# EAGLE design Blocky_Uno_v2 (EAGLE 9.2.2)
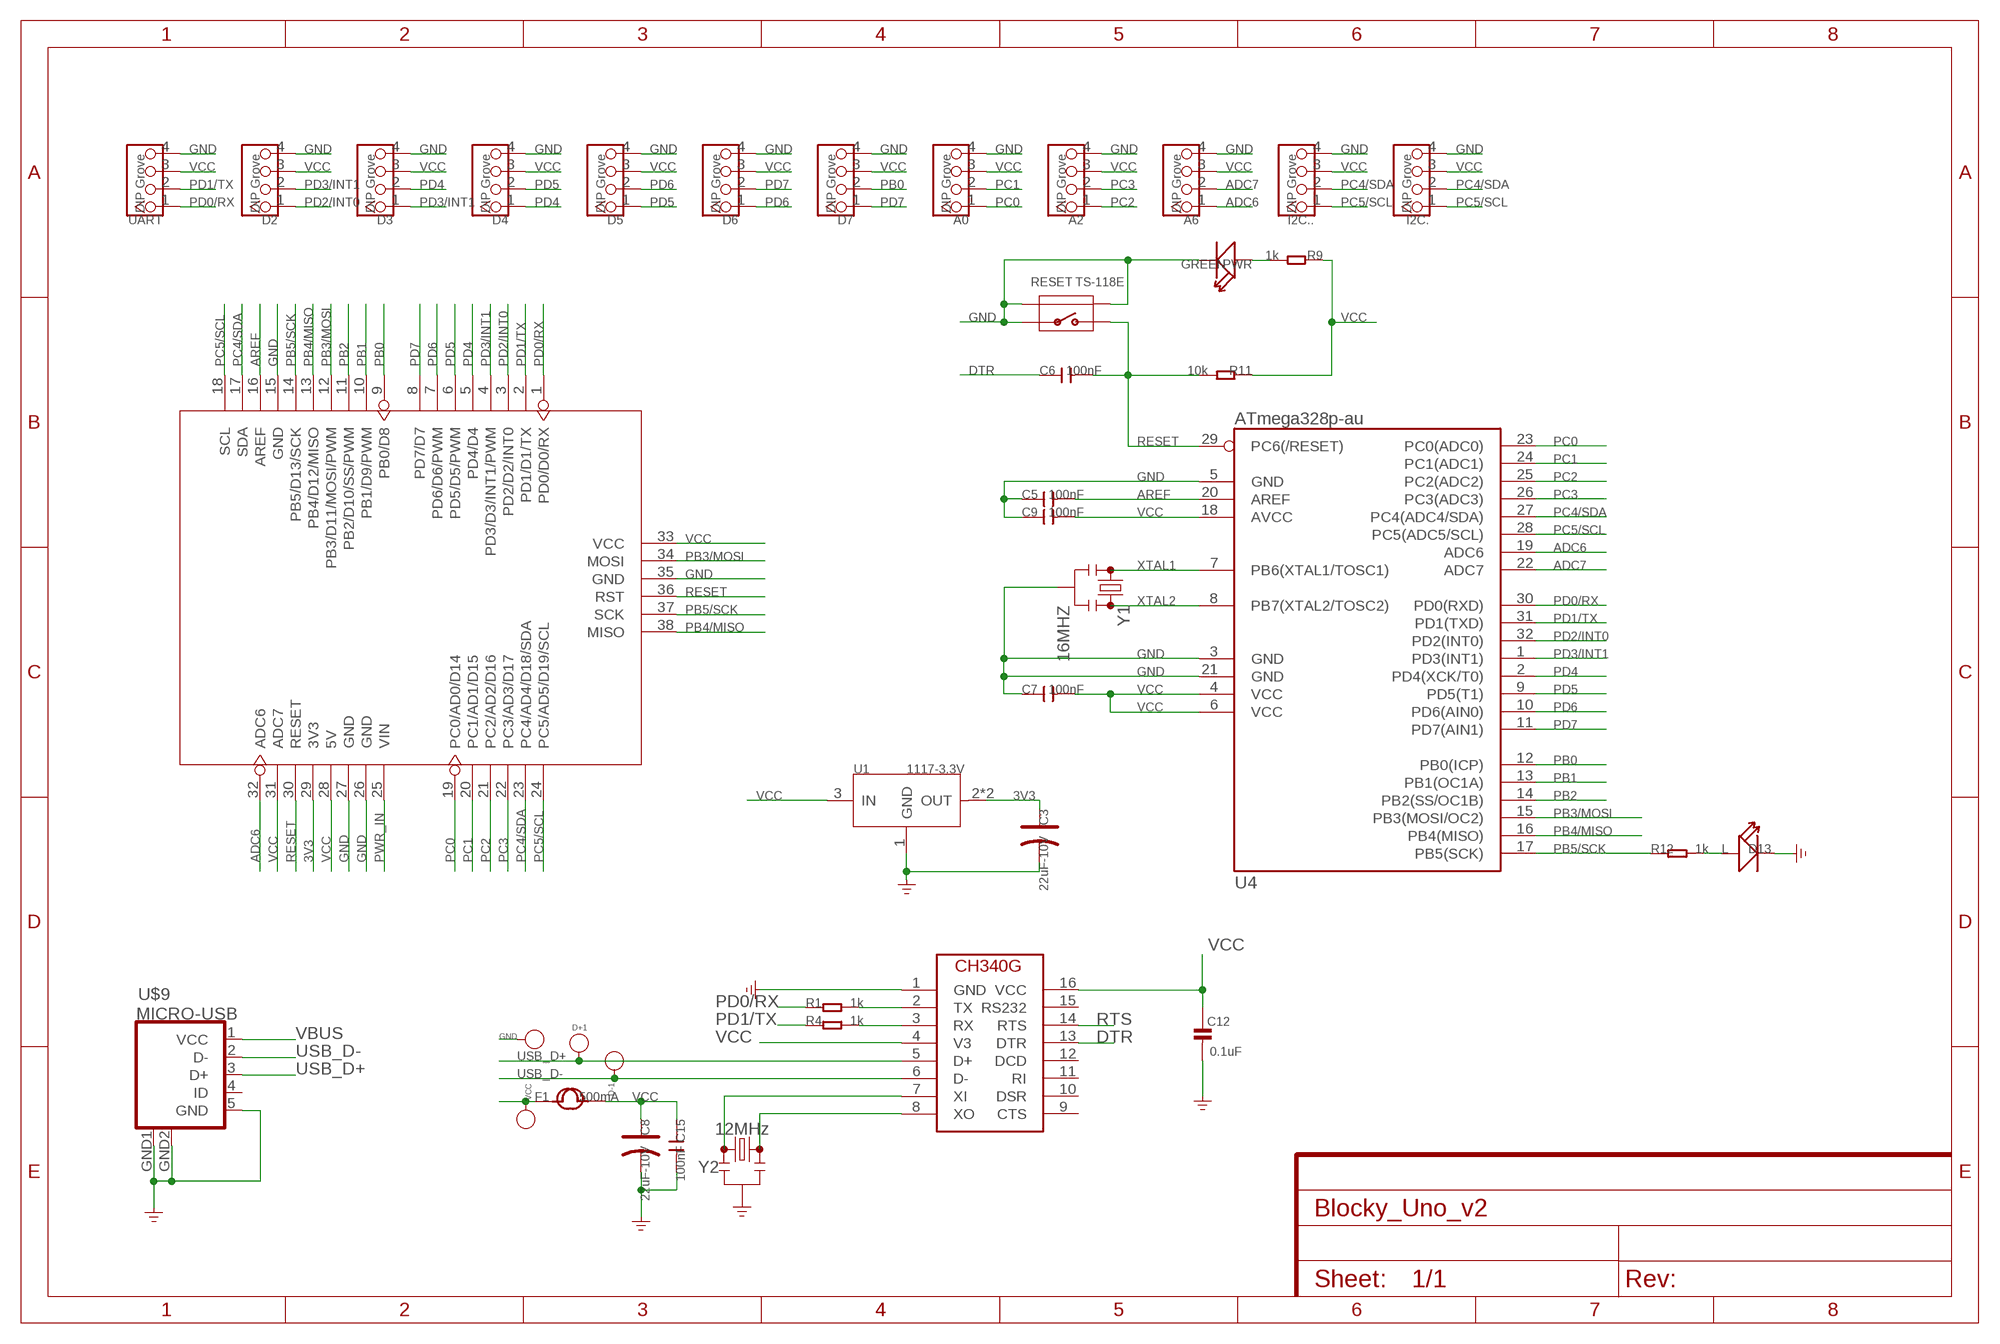
[diagram p0: schematic, sheet 1]

## Parts
A0  DIP Grove  TWIG-4P-2.0-2.0  [4P-2.0]
A2  DIP Grove  TWIG-4P-2.0-2.0  [4P-2.0]
A6  DIP Grove  TWIG-4P-2.0-2.0  [4P-2.0]
C3  22uF-10V  CAP-AVX-A  [AVX-A]
C5  100nF  C-0603  [C0603]
C6  100nF  C-0603  [C0603]
C7  100nF  C-0603  [C0603]
C8  22uF-10V  CAP-AVX-A  [AVX-A]
C9  100nF  C-0603  [C0603]
C12  0.1uF  CAP_CERAMIC_0603  [_0603]
C15  100nF  C-0603  [C0603]
D2  DIP Grove  TWIG-4P-2.0-2.0  [4P-2.0]
D3  DIP Grove  TWIG-4P-2.0-2.0  [4P-2.0]
D4  DIP Grove  TWIG-4P-2.0-2.0  [4P-2.0]
D5  DIP Grove  TWIG-4P-2.0-2.0  [4P-2.0]
D6  DIP Grove  TWIG-4P-2.0-2.0  [4P-2.0]
D7  DIP Grove  TWIG-4P-2.0-2.0  [4P-2.0]
D+1  PAD-TEST-POINT'4545'  [TP_4545]
D-1  PAD-TEST-POINT'4545'  [TP_4545]
F1  500mA  FUSE'1206'  [F1206]
GND  PAD-TEST-POINT'4545'  [TP_4545]
I2C.  DIP Grove  TWIG-4P-2.0-2.0  [4P-2.0]
I2C..  DIP Grove  TWIG-4P-2.0-2.0  [4P-2.0]
L  D13  LED'0603'  [LED-0603]
PWR  GREEN  LED'0603'  [LED-0603]
R1  1k  R-0603  [R0603]
R4  1k  R-0603  [R0603]
R9  1k  R-0603  [R0603]
R11  10k  R-0603  [R0603]
R12  1k  R-0603  [R0603]
RESET  TS-118E  BUTTON-4P-REINFORCE'TS-1188E'  [4P-SMD-7X3.5X3.5H]
U1  1117-3.3V  LD1117'SOT89'  [SOT89]
U3  ARDUINO-38P  [ARDUINO-38P]
U4  ATmega328p-au  ATMEGA8/168/328  [TQFP32]
U$9  MICRO-USB  [MICRO-USB]
U$44  CH340G  [SOIC16]
UART  DIP Grove  TWIG-4P-2.0-2.0  [4P-2.0]
VCC  PAD-TEST-POINT'4545'  [TP_4545]
Y1  16MHZ  RESONATOR16MHZ  [RESONATOR-SMD]
Y2  12MHz  RESONATOR-16MHZSMD_3.2X1.3  [RESONATOR-SMD-3.2X1.3]

## Nets
3V3: C3.+ U1.2(OUT) U1.4(OUT) U3.29(3V3)
ADC6: A6.1 U3.32(ADC6) U4.19(ADC6)
ADC7: A6.2 U4.22(ADC7)
AREF: C5.2 U3.16(AREF) U4.20(AREF)
DTR: C6.1 U$44.13(DTR)
GND: A0.4 A2.4 A6.4 C3.- C5.1 C7.1 C8.- C9.1 C12.2 C15.2 D2.4 D3.4 D4.4 D5.4 D6.4 D7.4 GND.T I2C..4 I2C...4 L.- PWR.- RESET.1 RESET.S1 RESET.S2 U1.1(GND) U3.15(GND) U3.26(GND) U3.27(GND) U3.35(GND) U4.3(GND) U4.5(GND) U4.21(GND) U$9.5(GND) U$9.GND1(GND) U$9.GND2(GND) U$44.1(GND) UART.4 Y1.2 Y2.2
N$3: PWR.+ R9.2
N$6: U$44.7(XI) Y2.1
N$10: U$44.8(XO) Y2.3
N$13: L.+ R12.2
N$21: R1.2 U$44.2(TX)
N$27: R4.2 U$44.3(RX)
PB0: D7.2 U3.9(PB0/D8) U4.12(PB0(ICP))
PB1: U3.10(PB1/D9/PWM) U4.13(PB1(OC1A))
PB2: U3.11(PB2/D10/SS/PWM) U4.14(PB2(SS/OC1B))
PB3/MOSI: U3.12(PB3/D11/MOSI/PWM) U3.34(MOSI) U4.15(PB3(MOSI/OC2))
PB4/MISO: U3.13(PB4/D12/MISO) U3.38(MISO) U4.16(PB4(MISO))
PB5/SCK: R12.1 U3.14(PB5/D13/SCK) U3.37(SCK) U4.17(PB5(SCK))
PC0: A0.1 U3.19(PC0/AD0/D14) U4.23(PC0(ADC0))
PC1: A0.2 U3.20(PC1/AD1/D15) U4.24(PC1(ADC1))
PC2: A2.1 U3.21(PC2/AD2/D16) U4.25(PC2(ADC2))
PC3: A2.2 U3.22(PC3/AD3/D17) U4.26(PC3(ADC3))
PC4/SDA: I2C..2 I2C...2 U3.17(SDA) U3.23(PC4/AD4/D18/SDA) U4.27(PC4(ADC4/SDA))
PC5/SCL: I2C..1 I2C...1 U3.18(SCL) U3.24(PC5/AD5/D19/SCL) U4.28(PC5(ADC5/SCL))
PD0/RX: R1.1 U3.1(PD0/D0/RX) U4.30(PD0(RXD)) UART.1
PD1/TX: R4.1 U3.2(PD1/D1/TX) U4.31(PD1(TXD)) UART.2
PD2/INT0: D2.1 U3.3(PD2/D2/INT0) U4.32(PD2(INT0))
PD3/INT1: D2.2 D3.1 U3.4(PD3/D3/INT1/PWM) U4.1(PD3(INT1))
PD4: D3.2 D4.1 U3.5(PD4/D4) U4.2(PD4(XCK/T0))
PD5: D4.2 D5.1 U3.6(PD5/D5/PWM) U4.9(PD5(T1))
PD6: D5.2 D6.1 U3.7(PD6/D6/PWM) U4.10(PD6(AIN0))
PD7: D6.2 D7.1 U3.8(PD7/D7) U4.11(PD7(AIN1))
PWR_IN: U3.25(VIN)
RESET: C6.2 R11.2 RESET.2 U3.30(RESET) U3.36(RST) U4.29(PC6(/RESET))
RTS: U$44.14(RTS)
USB_D+: D+1.T U$9.3(D+) U$44.5(D+)
USB_D-: D-1.T U$9.2(D-) U$44.6(D-)
VBUS [usbvcc]: F1.1 U$9.1(VCC) VCC.T
VCC: A0.3 A2.3 A6.3 C7.2 C8.+ C9.2 C12.1 C15.1 D2.3 D3.3 D4.3 D5.3 D6.3 D7.3 F1.2 I2C..3 I2C...3 R9.1 R11.1 U1.3(IN) U3.28(5V) U3.31(ADC7) U3.33(VCC) U4.4(VCC) U4.6(VCC) U4.18(AVCC) U$44.4(V3) U$44.16(VCC) UART.3
XTAL1: U4.7(PB6(XTAL1/TOSC1)) Y1.1
XTAL2: U4.8(PB7(XTAL2/TOSC2)) Y1.3
Unconnected: U$9.4(ID) U$44.9(CTS) U$44.10(DSR) U$44.11(RI) U$44.12(DCD) U$44.15(RS232)

## Library data of the parts
A0 A2 A6 = Connector :TWIG-4P-2.0
C3 C8 = Discrete:CAP*: Electrolytic Capacitors,Tantalum Capacitors and Super Capacitors
C5-C7 C9 C15 = Discrete:C*: Ceramic Capacitors
C12 = microbuilder:CAP_CERAMIC: Ceramic Capacitors 0402 - 0402 Surface Mount Capacitors 16pF 50V 5% [Digikey: 445-4899-2-ND] 18pF 50V 5% [Digikey: 490-1281-2-ND] 22pF 50V 5% [Digikey: 490-1283-2-ND] 68pF 50V 5% [Digikey: 490-1289-2-ND] 0.1uF 10V 10% [Digikey: 490-1318-2-ND] 1.0uF 6.3V 10% [Digikey: 490-1320-2-ND] 0603 - 0603 Surface Mount Capacitors 16 pF 50V 5% [Digikey: 445-5051-2-ND] 22 pF 50V [Digikey: PCC220ACVTR-ND] 33 pF 50V 5% [Digikey: 490-1415-1-ND] 56pF 50V 5% [Digikey: 490-1421-1-ND] 220pF 50V 5% [Digikey: 445-1285-1-ND] 680 pF 50V 2200 pF 50V 5% C0G [Digikey: 445-1297-1-ND] 5600 pF 100V 5% X7R [Digikey: 478-3711-1-ND] 0.1 µF 25V 10% [Digikey: PCC2277TR-ND] 0.22 µF 16V 10% X7R [Digikey: 445-1318-1-ND] 1.0 µF 25V 10% [Digikey: 445-5146-2-ND] 0603 - RF Specific 3pF 250V +/-0.1pF RF [Digikey: 712-1347-1-ND] 18 pF 250V 5% [Digikey: 478-3505-1-ND or 712-1322-1-ND] 56 pF 250V 5% C0G RF [Digikey: 490-4867-1-ND] 68 pF 250V RF [Digikey: 490-4868-1-ND] 0805 - 0805 Surface Mount Capacitors 220 pF 250V 2% RF Ceramic Capacitor [Digikey: 712-1398-1-ND] 1000 pF 50V 2% NP0 Ceramic Capacitor [Digikey: 478-3760-1-ND] 0.1 µF 25V 10% Ceramic Capacitor [Digikey: PCC1828TR-ND] 1.0 µF 16V 10% Ceramic Capacitor[Digikey: 490-1691-2-ND] 10.0 µF 10V 10% Ceramic Capacitor[Digikey: 709-1228-1-ND] 10.0 uF 16V 10% Ceramic Capacitor [Digikey: 478-5165-2-ND] 47 uF 6.3V 20% Ceramic Capacitor [Digikey: 587-1779-1-ND or 399-5506-1-ND] 1206 - 1206 Surface Mount Capacitors 47uF 10V 20% Ceramic Capacitor [Digikey: 490-5528-1-ND or 399-5508-1-ND or 445-6010-1-ND] 100uF 6.3V -20%, +80% Y5V Ceramic Capacitor (Digikey: 490-4512-1-ND, Mouser: 81-GRM31CF50J107ZE1L)
D2-D7 I2C. I2C.. UART = Connector:TWIG-4P-2.0
D+1 D-1 GND VCC = Discrete:PAD-TEST-POINT; PARTNO: DNP
F1 = Discrete:FUSE
L PWR = Discrete:LED*
R1 R4 R9 R11 R12 = Discrete:R*
RESET = Discrete:BUTTON-4P-REINFORCE: TS-1188E http://www.best-dz.com/?thread-374-2.html
U1 = IC:LD1117: Low Drop Fixed And Adjustable Positive Voltage Regulators http://www.datasheetcatalog.org/datasheet/SGSThomsonMicroelectronics/mXuqtqv.pdf
U3 = moudle:ARDUINO-38P
U4 = IC:ATMEGA8/168/328: MICROCONTROLLER
U$9 = My-Eagle-Lib:MICRO-USB: Micro USB B connector
U$44 = My-Eagle-Lib:CH340G
Y1 = SparkFun-FreqCtrl:RESONATOR: Resonator Small SMD resonator. Used, eg, on the Arduino Pro/ Pro Mini boards. 8MHz- XTAL-08895 16MHz- XTAL-08900; PROD_ID: XTAL-08900
Y2 = SparkFun-Clocks:RESONATOR-16MHZ: 16MHz Resonator Digikey Example <http://www.digikey.com/product-detail/en/murata-electronics-north-america/CSTCE16M0V53-R0/490-1198-1-ND/584635> Frequency: 16MHz Frequency Stability: ±0.3% Frequency Tolerance: ±0.5% Capacitance: 15pF SparkFun Products SparkFun OpenLog <https://www.sparkfun.com/products/13712> SparkFun MicroView - OLED Arduino Module <https://www.sparkfun.com/products/12923>; PROD_ID: XTAL-08900; VALUE: 16MHz

## Net classes
1 power: width 0.381 mm
3 usbvcc: width 0.203 mm, drill 0.305 mm, clearance 0.203 mm

## Board
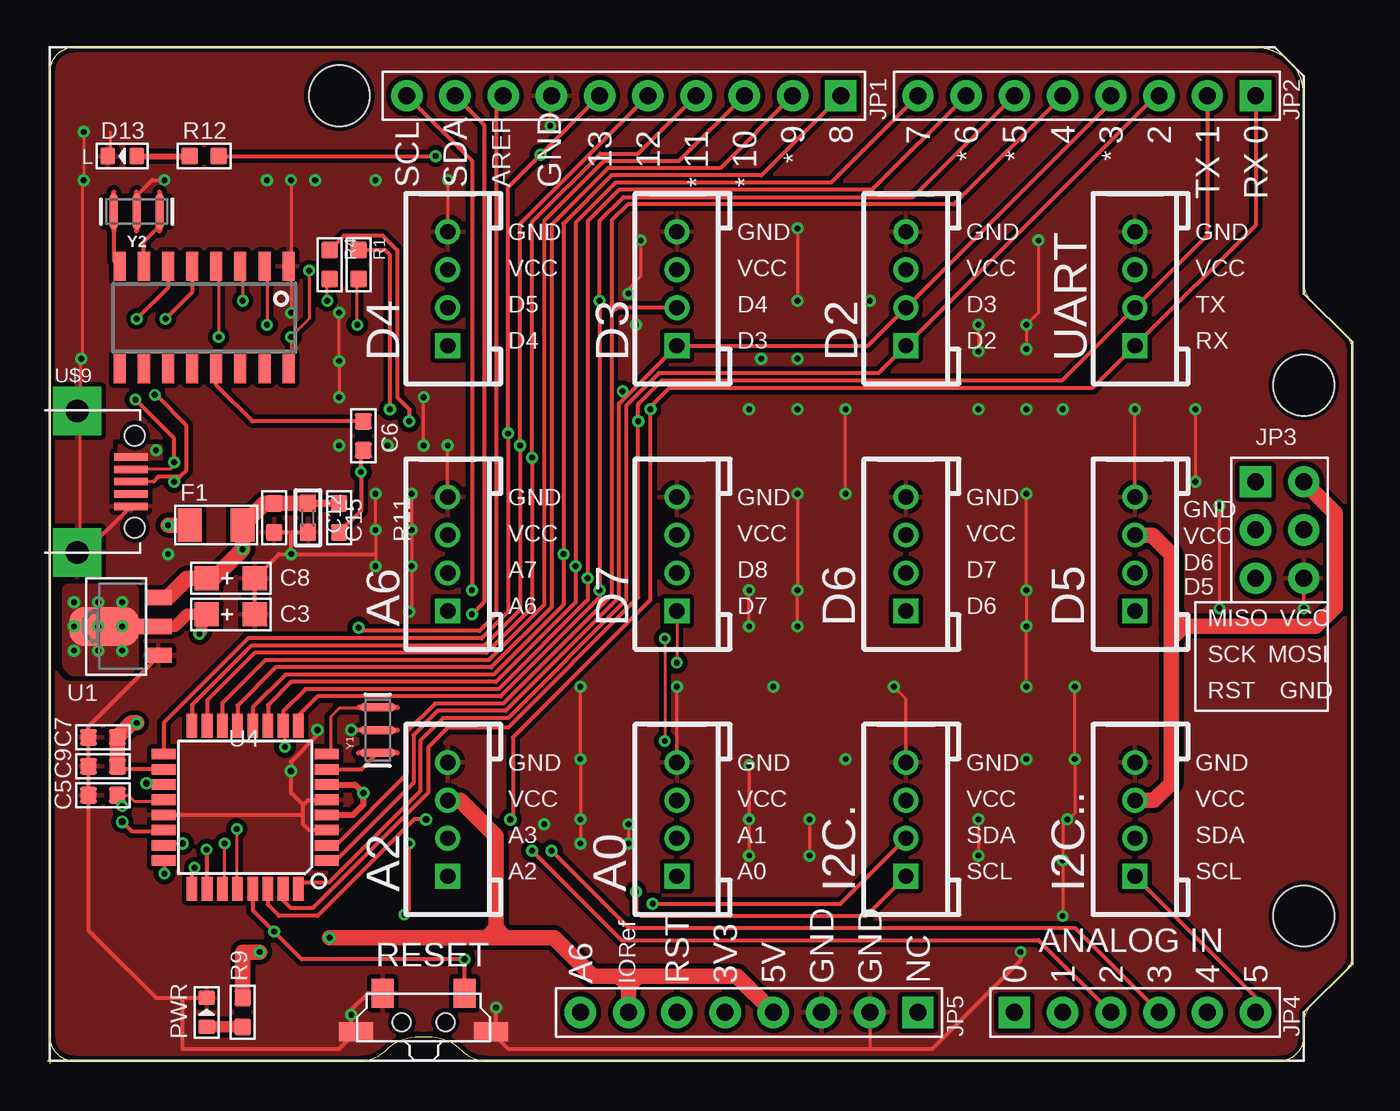
[diagram p1: board, top side]
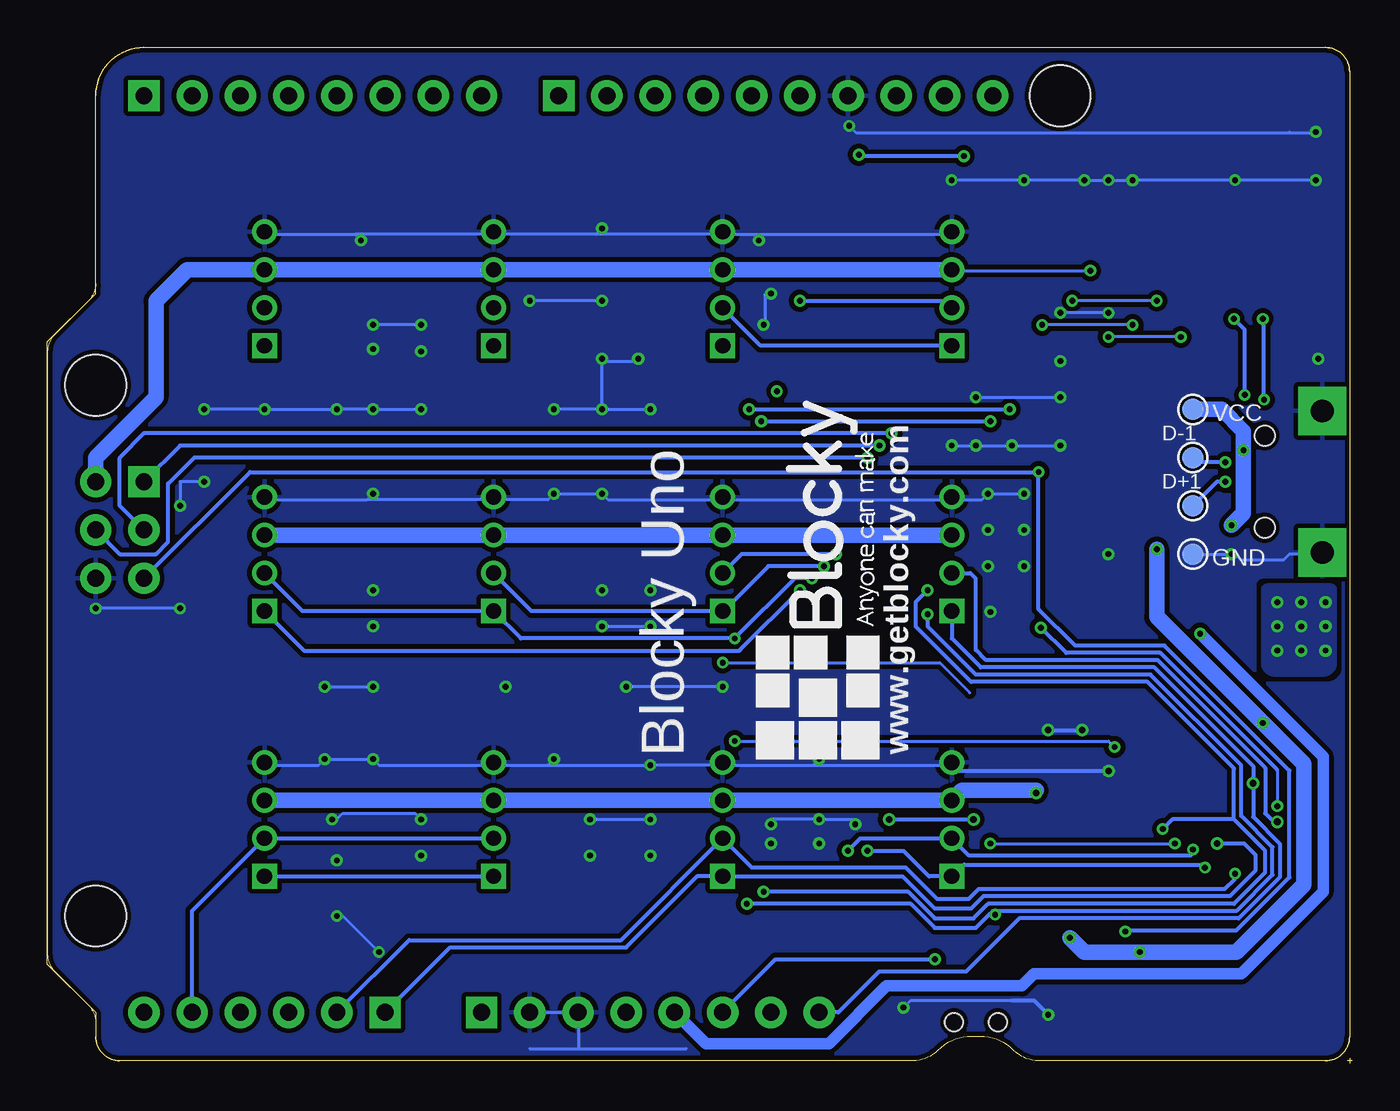
[diagram p2: board, bottom side, seen from below]

Size 68.71 x 53.47 mm. Coordinates in mm from the lower left corner, seen from the top.
Outline: 1.4,0.13 arc-90 0.13,1.4
Outline: 0.13,52.2 arc-90 1.4,53.47
Outline: 63.63,53.47 arc-90 66.17,50.93
Outline: 66.17,41.04 arc45 66.54,40.14 68.33,38.35 arc-45 68.71,37.45 68.71,5.73 arc-45 68.33,4.83 66.54,3.04 arc45 66.17,2.14
Outline: 66.17,2.14 66.17,1.4
Outline: 66.17,1.4 arc-90 64.9,0.13
Outline: 0.13,1.4 arc90 1.4,0.13
Outline: 64.9,0.13 arc90 66.17,1.4
Outline: 1.4,53.47 arc90 0.13,52.2
Outline: 0.13,1.4 arc90 1.4,0.13
Outline: 64.9,0.13 arc90 66.17,1.4
Outline: 66.17,50.93 arc90 63.63,53.47
Outline: 66.17,1.4 arc-90 64.9,0.13
Outline: 1.4,53.47 arc90 0.13,52.2
Outline: 0.13,1.4 arc90 1.4,0.13
Outline: 66.17,41.04 66.17,40.51 68.71,37.97 68.71,5.21 66.17,2.67 66.17,2.14
Outline: 66.17,50.93 arc90 63.63,53.47
Outline: 21.83,0.65 arc45 23.1,0.13
Outline: 16.53,0.13 arc45 17.8,0.65
Outline: 17.8,0.65 arc-45 19.59,1.4
Outline: 20.03,1.4 arc-45 21.83,0.65
Outline: 0.13,1.4 arc90 1.4,0.13
Outline: 64.9,0.13 arc90 66.17,1.4
Outline: 1.4,53.47 arc90 0.13,52.2
Outline: 0.13,1.4 arc90 1.4,0.13
Outline: 64.9,0.13 arc90 66.17,1.4
Outline: 66.17,50.93 arc90 63.63,53.47
Outline: 66.17,1.4 arc-90 64.9,0.13
Outline: 63.63,53.47 1.4,53.47
Outline: 1.4,53.47 arc90 0.13,52.2
Outline: 0.13,52.2 0.13,1.4
Outline: 0.13,1.4 arc90 1.4,0.13
Outline: 66.17,41.04 66.17,50.93
Outline: 66.17,50.93 arc90 63.63,53.47
Outline: 21.83,0.65 arc45 23.1,0.13
Outline: 23.1,0.13 64.9,0.13
Outline: 1.4,0.13 16.53,0.13
Outline: 16.53,0.13 arc45 17.8,0.65
Outline: 17.8,0.65 arc-45 19.59,1.4
Outline: 19.59,1.4 20.03,1.4
Outline: 20.03,1.4 arc-45 21.83,0.65
Outline: 0,0.13 0.25,0.13
Outline: 0.13,0.25 0.13,0
Copper layers (1*16): Top 0.035mm / dielectric 1.5mm / Bottom 0.035mm
Design rules "SeeedStudio_rule_no_angle_090911 *": minimum track width 6mil, minimum drill 12mil, track to track 6mil, track to pad 6mil, pad to pad 6mil, via to via 6mil, smd to smd 0mil, copper to edge 10mil, drill to drill 10mil, minimum pad ring 10mil, minimum via ring 6mil, stop-mask expansion 2mil, vias tented up to drill 100mil, thermal gap 10mil

### Footprints (pad centres in the part's own frame; a part is rotated, then mirrored left to right if it is on the bottom)
4P-2.0 = drill 0.8 pad 1.27 square: 1 -3,0 | drill 0.8 pad 1.27: 2 -1,0; 3 1,0; 4 3,0
AVX-A = smd 1.27 x 1.27: + -1.27,0; - 1.27,0
C0603 = smd 0.889 x 0.889: 1 -0.762,0; 2 0.762,0
_0603 = smd 0.9 x 0.8: 1 -0.762,0; 2 0.762,0
TP_4545 = smd 1.143 x 1.143: T 0,0
F1206 = smd 1.27 x 1.778: 1 -1.397,0; 2 1.397,0
LED-0603 = smd 0.762 x 0.889: + -0.762,0; - 0.762,0
R0603 = smd 0.889 x 0.889: 1 -0.762,0; 2 0.762,0
4P-SMD-7X3.5X3.5H = smd 1.143 x 1.524: 1 -2.159,1.524; 2 2.159,1.524 | smd 1.778 x 1.016: S1 -3.556,-0.508; S2 3.556,-0.508 | hole 0.95: -1.15,0; 1.15,0
SOT89 = smd 0.8 x 1.4: 1 -1.524,-1.905; 3 1.524,-1.905 | smd 0.8 x 1.9: 2 0,-1.651 | smd 2.032 x 3.65: 4 0,0.94
ARDUINO-38P = drill 0.889 pad 1.651 square: 1 63.5,50.8; 9 41.656,50.8; 19 50.8,2.54; 25 45.72,2.54; 38 63.5,30.48 | drill 0.889 pad 1.651: 2 60.96,50.8; 3 58.42,50.8; 4 55.88,50.8; 5 53.34,50.8; 6 50.8,50.8; 7 48.26,50.8; 8 45.72,50.8; 10 39.116,50.8; 11 36.576,50.8; 12 34.036,50.8; 13 31.496,50.8; 14 28.956,50.8; 15 26.416,50.8; 16 23.876,50.8; 17 21.336,50.8; 18 18.796,50.8; 20 53.34,2.54; 21 55.88,2.54; 22 58.42,2.54; 23 60.96,2.54; 24 63.5,2.54; 26 43.18,2.54; 27 40.64,2.54; 28 38.1,2.54; 29 35.56,2.54; 30 33.02,2.54; 31 30.48,2.54; 32 27.94,2.54; 33 66.04,30.48; 34 66.04,27.94; 35 66.04,25.4; 36 63.5,25.4; 37 63.5,27.94 | hole 3.2: 15.24,50.8; 66.04,35.56; 66.04,7.62
TQFP32 = smd 1.27 x 0.559: 1 -4.293,2.8; 2 -4.293,2; 3 -4.293,1.2; 4 -4.293,0.4; 5 -4.293,-0.4; 6 -4.293,-1.2; 7 -4.293,-2; 8 -4.293,-2.8; 17 4.293,-2.8; 18 4.293,-2; 19 4.293,-1.2; 20 4.293,-0.4; 21 4.293,0.4; 22 4.293,1.2; 23 4.293,2; 24 4.293,2.8 | smd 0.559 x 1.27: 9 -2.8,-4.293; 10 -2,-4.293; 11 -1.2,-4.293; 12 -0.4,-4.293; 13 0.4,-4.293; 14 1.2,-4.293; 15 2,-4.293; 16 2.8,-4.293; 25 2.8,4.293; 26 2,4.293; 27 1.2,4.293; 28 0.4,4.293; 29 -0.4,4.293; 30 -1.2,4.293; 31 -2,4.293; 32 -2.8,4.293
MICRO-USB = smd 0.4 x 1.75: 1 -1.3,4.525; 2 -0.65,4.525; 3 0,4.525; 4 0.65,4.525; 5 1.3,4.525 | drill 1.2 pad 2.54 square: GND1 -3.725,1.7; GND2 3.725,1.7 | hole 1.05: -2.425,4.73; 2.425,4.73
SOIC16 = smd 0.635 x 1.524: 1 -4.445,-2.695; 2 -3.175,-2.695; 3 -1.905,-2.695; 4 -0.635,-2.695; 5 0.635,-2.695; 6 1.905,-2.695; 7 3.175,-2.695; 8 4.445,-2.695; 9 4.445,2.695; 10 3.175,2.695; 11 1.905,2.695; 12 0.635,2.695; 13 -0.635,2.695; 14 -1.905,2.695; 15 -3.175,2.695; 16 -4.445,2.695
RESONATOR-SMD = smd 0.45 x 1.905: 1 -1.2,0; 2 0,0; 3 1.2,0
RESONATOR-SMD-3.2X1.3 = smd 0.45 x 1.905: 1 -1.2,0; 2 0,0; 3 1.2,0

### Placement (x,y rotation side)
A0  33.15,12.83 90 top
A2  21.08,12.83 90 top
A6  21.08,26.8 90 top
C3  9.65,23.62 0 top
C5  2.92,14.1 0 top
C6  16.64,33.02 270 top
C7  2.92,17.14 0 top
C8  9.65,25.53 0 top
C9  2.92,15.62 0 top
C12  13.72,28.7 270 top
C15  11.94,28.7 270 top
D2  45.21,40.77 90 top
D3  33.15,40.77 90 top
D4  21.08,40.77 90 top
D5  57.28,26.8 90 top
D6  45.21,26.8 90 top
D7  33.15,26.8 90 top
D+1  8.38,29.34 0 bottom
D-1  8.38,31.88 0 bottom
F1  8.89,28.32 0 top
GND  8.38,26.8 0 bottom
I2C.  45.21,12.83 90 top
I2C..  57.28,12.83 90 top
L  3.94,47.75 180 top
PWR  8.38,2.67 90 top
R1  16.38,42.04 270 top
R4  14.86,42.04 270 top
R9  10.29,2.67 270 top
R11  15.37,28.7 270 top
R12  8.26,47.75 180 top
RESET  19.81,2.16 0 top
U1  3.94,22.99 90 top
U3  0.13,0.13 0 top
U4  10.41,13.46 180 top
U$4  [BLOCKY_LOGO]  24.64,14.99 90 bottom
U$9  -0.13,30.61 270 top
U$44  8.26,39.24 180 top
UART  57.28,40.77 90 top
VCC  8.38,34.42 0 bottom
Y1  17.4,17.53 90 top
Y2  4.7,44.83 180 top

### Tracks (layer width: path | path; a pad name or v marks a point on that pad's centre or on a via)
3V3  (via drill 0.3 pad 0.64)
  Top 0.61: v8,22.61 8.13,22.73 8.13,23.49 8.26,23.62 | v3.94,22.99 U1.4 | U1.2 6.73,22.99 7.37,23.62 C3.+
  Top 0.813: C3.+ 8.26,23.62
  Bottom 0.61: U3.29 34.04,1.02 27.56,1.02 24.51,4.06 17.4,4.06 16.76,4.7 5.84,4.7 1.52,9.02 1.52,16.13 v8,22.61
  other vias: 3.94,24.26 2.67,24.26 1.4,24.26 2.67,22.99 1.4,22.99 1.4,21.72 2.67,21.72 3.94,21.72
  pour Top (isolate 0.254, no thermals): 4.06,20.45 1.52,20.45 arc-90 0.89,21.08 0.89,24.89 arc-90 1.14,25.15 4.44,25.15 arc-90 4.7,24.89 4.7,21.08 arc-90
  pour Bottom (isolate 0.254, no thermals): 4.06,20.45 1.52,20.45 arc-90 0.89,21.08 0.89,24.89 arc-90 1.14,25.15 4.44,25.15 arc-90 4.7,24.89 4.7,21.08 arc-90
ADC6  (via drill 0.35)
  Top 0.203: U4.19 5.28,14.66 v5.21,14.73
  Bottom 0.203: U3.32 27.05,2.67 24.89,4.83 20.32,4.83 17.53,7.62 5.97,7.62 3.81,9.78 3.81,11.56 5.21,12.95 v5.21,14.73 5.21,15.63 10.41,20.83 19.56,20.83 21.08,22.35 A6.1
ADC7  (via drill 0.35)
  Top 0.152: U4.22 6.15,12.24 6.15,12.19
  Top 0.203: v3.94,12.7 4.44,12.19 6.15,12.19 6.16,12.19
  Bottom 0.152: 19.81,25.53 19.81,25.51
  Bottom 0.203: A6.2 20.1,25.8 19.81,25.51 19.81,21.75 19.27,21.21 10.24,21.21 4.57,15.54 4.57,13.15 4.13,12.7 v3.94,12.7
AREF  (via drill 0.3, 0.3 pad 0.64)
  Top 0.152: v3.94,13.53 3.94,14.1 | 3.94,14.1 4.25,14.1 4.57,13.78 5.84,13.78 5.84,13.84 6.07,13.84 U4.20 | 3.94,14.1 C5.2
  Top 0.203: U3.16 23.62,50.55 23.62,23.62 22.75,22.75 16.62,22.75 16.45,22.92 v16.38,22.92
  Bottom 0.152: 3.94,15.43 v3.94,13.53
  Bottom 0.203: 3.94,15.43 10.1,21.59 15.05,21.59 v16.38,22.92
DTR
  Top 0.203: U$44.13 8.89,35.69 10.79,33.78 C6.1
GND  (via drill 0.3, 0.3 pad 0.64, 0.35)
  Top 0.152: v51.56,37.59 v51.56,38.86 52.2,39.5 v52.2,43.31 | v49.02,38.86 v49.02,37.47 | v39.5,43.94 v39.5,40.13 | v31.24,43.31 31.24,41.4 30.61,40.77 v30.61,40.51 | 4.57,29.34 U$9.5 | U$9.GND2 1.71,27.11 1.71,34.1 U$9.GND1 1.71,34.42 1.71,37.02 v1.78,37.08 1.84,37.15 1.84,46.42 v1.91,46.48 v1.91,49.02 | v15.37,35.05 v15.37,36.96 v15.37,39.5 | v12.83,46.48 12.83,42.04 12.78,42.04 12.7,41.96 U$44.1 | v12.83,39.5 12.83,41.72 12.78,41.73 U$44.1 | 3.3,49.02 3.3,47.75 L.- | v26.48,49.34 26.48,50.93 U3.15 | v21.08,46.48 D4.4 | v60.45,34.42 v60.45,30.61 | D5.4 v57.28,34.42 | v66.17,23.94 U3.35 | v61.72,29.34 v61.72,23.94 | v17.27,26.16 17.27,26.8 v17.27,28.07 v17.27,29.97 | v19.05,23.75 19.18,23.94 v19.18,26.16 v19.18,28.07 v19.18,29.97 | A6.4 v21.08,32.51 | v36.96,22.99 v36.96,24.89 | v39.5,22.99 v39.5,24.89 v39.5,29.97 | v42.04,29.97 v42.04,34.42 | 23.94,1.71 23.62,1.4 23.49,1.52 RESET.S2 | 2.35,14.1 C5.1 | 2.35,16.95 C7.1 | 5.84,21.4 U1.1 | 2.67,6.48 2.35,6.79 | 14.73,12.19 U4.3 | 18.22,17.53 Y1.2 v16,17.53 | v30.61,12.57 v30.61,11.56 | v28.07,11.56 v28.07,12.83 v28.07,16 v28.07,19.81 | v36.96,10.92 v36.96,12.83 v36.96,15.68 | v40.13,12.83 v40.13,10.92 | A0.4 v33.15,19.81 | U3.26 43.31,0.76 | v44.58,19.81 45.21,19.18 I2C..4 | v51.56,19.81 v51.56,22.99 v51.56,24.89 v51.56,29.97 | v49.02,12.83 v49.02,10.92 | v54.1,19.81 v54.1,16 54.1,13.15 53.78,12.83 v53.72,12.83 53.47,12.83 v53.47,10.67 v53.47,7.75 | v19.81,32.51 v19.81,35.05 | 12.85,41.73 12.7,41.89 U$44.1
  Top 0.203: U4.3 13.77,12.26 13.46,12.57 13.46,13.08 | 13.46,13.08 13.46,13.59 | 13.46,13.59 13.72,13.84 14.69,13.84 U4.5 | Y2.2 4.7,45.66 5.52,46.48 v6.16,46.48 | 13.46,13.59 12.83,14.22 v12.83,15.37 12.83,15.88 14.22,17.27 v14.22,17.53 | U4.21 13.44,13.06 13.46,13.08 | 6.98,3.43 5.71,3.43 2.67,6.48 2.16,6.98 C5.1 C9.1 C7.1 2.16,17.72 5.84,21.4 | 6.98,3.43 PWR.- | RESET.1 16.89,3.68 16,2.79 v16,2.54 16,1.91 RESET.S1 15.37,0.76 7.11,0.76 7.11,3.3 6.98,3.43 | RESET.S2 23.62,1.91 v23.62,2.92 | 23.49,1.52 24.26,0.76 43.31,0.76 46.61,0.76 51.24,5.4 v51.24,5.84 | 4.43,29.34 U$9.5 1.97,26.88 U$9.GND2 | 13.59,28.07 C12.2 12.83,27.94 | 12.07,28.07 C15.2 12.83,27.94 | v12.83,26.8 12.83,27.94 | v12.83,26.8 17.27,26.8 | C3.- C8.- 12.19,26.8 v12.83,26.8
  Bottom 0.152: v49.02,38.86 v51.56,38.86 | 52.52,43.62 v52.2,43.31 | 52.52,43.62 57.28,43.62 UART.4 | v39.5,40.13 v43.31,40.13 | 39.82,43.62 45.21,43.62 | v39.5,43.94 39.82,43.62 | v30.99,38.86 30.92,38.86 30.92,40.45 30.61,40.45 v30.61,40.51 | 31.56,43.62 v31.24,43.31 | 33.15,43.62 31.56,43.62 | 31.56,43.62 21.08,43.62 D4.4 | 33.15,43.62 39.82,43.62 | 33.15,43.62 D3.4 | 45.21,43.62 52.52,43.62 | 45.21,43.62 D2.4 | GND.T v6.35,26.8 6.16,26.8 5.84,26.48 3.62,26.48 3.3,26.8 1.71,26.8 U$9.GND2 | v12.83,39.5 v15.37,39.5 | 3.3,48.96 1.97,48.96 v1.91,49.02 | 3.3,48.96 3.3,49.02 | v1.91,46.48 v6.16,46.48 v11.56,46.48 v12.83,46.48 v14.1,46.48 v17.27,46.48 v21.08,46.48 | v26.48,49.34 26.1,48.96 3.3,48.96 | v61.72,29.34 61.72,30.61 v60.45,30.61 | v49.02,34.42 v51.56,34.42 v53.47,34.42 v57.28,34.42 v60.45,34.42 | 51.88,29.65 v51.56,29.97 | 51.88,29.65 57.28,29.65 D5.4 | v61.72,23.94 v66.17,23.94 | v15.37,32.51 v17.91,32.51 v19.81,32.51 v21.08,32.51 | 21.08,29.65 19.49,29.65 v19.18,29.97 v17.27,29.97 | 39.5,36.96 37.59,36.96 v37.59,37.08 | v39.5,34.42 v36.96,34.42 | v39.5,34.42 v42.04,34.42 | v39.5,34.42 39.5,36.96 | 39.5,36.96 v39.5,37.08 | v39.5,22.99 v36.96,22.99 | 45.21,29.65 42.35,29.65 v42.04,29.97 v39.5,29.97 39.18,29.65 33.15,29.65 | 33.15,29.65 21.08,29.65 | 21.08,29.65 A6.4 | 33.15,29.65 D7.4 | 45.21,29.65 51.88,29.65 | 45.21,29.65 D6.4 | v23.62,2.92 23.24,3.3 17.91,3.3 | v26.16,12.57 26.16,12.83 v28.07,12.83 30.61,12.83 v30.61,12.57 | v40.13,12.83 v36.96,12.83 | 28.38,15.68 v28.07,16 | 33.15,15.68 28.38,15.68 | v33.15,19.81 v38.23,19.81 | 33.15,15.68 v36.96,15.68 42.35,15.68 | 33.15,15.68 A0.4 | 28.38,15.68 21.08,15.68 A2.4 | U3.26 U3.27 40.74,2.64 40.74,0.76
  Bottom 0.152: 42.35,15.68 v42.04,16 | 45.21,15.68 42.35,15.68 | v54.1,19.81 v51.56,19.81 | v49.02,12.83 49.34,13.15 53.15,13.15 53.47,12.83 v53.72,12.83 | I2C...4 57.28,15.68 54.42,15.68 v54.1,16 v51.56,16 51.24,15.68 45.21,15.68 | 45.21,15.68 I2C..4 | v51.24,5.84 53.15,7.75 v53.47,7.75 | 43.31,0.76 40.74,0.76 | 40.74,0.76 35.05,0.76 | v19.81,35.05 v15.37,35.05
  Bottom 0.203: v12.83,15.37 20.76,15.37 21.08,15.68 | v16,17.53 v14.22,17.53 | 17.91,3.3 16.76,3.3 v16,2.54
  pour Bottom (isolate 0.254, rank 6): 0,0.13 68.71,0.13 68.71,53.47 0,53.47
  pour Top (isolate 0.254, rank 6): 0.13,0.13 68.71,0.13 68.71,53.47 0.13,53.47
N$3
  Top 0.61: PWR.+ R9.2
N$6
  Top 0.152: 5.9,44.07 Y2.1
  Top 0.203: U$44.7 5.08,43.25 5.9,44.07
N$10
  Top 0.203: Y2.3 3.5,42.25 U$44.8
N$13
  Top 0.305: L.+ R12.2
N$21  (via drill 0.3)
  Top 0.152: v16.32,38.86 16.32,41.09 16.36,41.12 16.36,41.28 R1.2 | v11.56,38.86 11.56,41.73 11.44,41.85 | 11.41,41.89 11.44,41.85 | U$44.2 11.48,41.89 11.44,41.85
  Bottom 0.152: v11.56,38.86 v16.32,38.86
N$27  (via drill 0.3)
  Top 0.152: v14.73,40.13 14.73,41.09 14.68,41.12 14.83,41.28 R4.2 | v10.29,40.13 10.29,41.72 10.26,41.73 | 10.11,41.89 10.15,41.85 | 10.15,41.85 10.26,41.73 | 10.15,41.85 10.19,41.89 U$44.3 10.26,41.73
  Bottom 0.152: v10.29,40.13 v14.73,40.13
PB0  (via drill 0.3 pad 0.64)
  Top 0.203: U3.9 37.59,46.74 29.72,46.74 27.18,44.2 v27.18,26.8 27.18,24.13 23.49,20.45 12.53,20.45 10.81,18.73 U4.12
  Bottom 0.203: v27.18,26.8 32.15,26.8 D7.2
PB1
  Top 0.203: U3.10 35.43,47.12 29.52,47.12 26.54,44.14 26.54,24 23.37,20.83 12.02,20.83 10.01,18.82 U4.13
PB2
  Top 0.152: 9.33,17.91 U4.14
  Top 0.203: U3.11 33.27,47.5 29.32,47.5 26.16,44.34 26.16,24.13 23.24,21.21 11.47,21.21 9.21,18.95 U4.14
PB3/MOSI  (via drill 0.3 pad 0.64)
  Top 0.203: U3.12 31.11,47.88 29.12,47.88 25.53,44.28 v25.53,31.88 25.53,24 23.11,21.59 10.9,21.59 8.41,19.11 U4.15
  Bottom 0.203: U3.34 64.9,26.8 62.99,26.8 62.36,27.43 62.36,30.5 60.98,31.88 v25.53,31.88
PB4/MISO  (via drill 0.3 pad 0.64)
  Top 0.203: U3.13 24.89,44.2 v24.89,32.51 24.89,23.88 22.99,21.97 10.73,21.97 7.61,18.85 U4.16
  Bottom 0.203: v24.89,32.51 61.72,32.51 U3.38
PB5/SCK  (via drill 0.3 pad 0.64)
  Top 0.203: U3.14 v25.97,47.82 24.26,46.1 v24.26,33.15 24.26,23.75 22.86,22.35 10.56,22.35 6.12,17.91 U4.17 | R12.1 v20.45,47.75
  Bottom 0.203: U3.37 64.9,29.34 64.9,31.88 63.63,33.15 v24.26,33.15 | v20.45,47.75 25.91,47.75 v25.97,47.82
PC0  (via drill 0.35)
  Top 0.152: v7.11,11.56 6.15,11.56 6.15,11.48 U4.23
  Bottom 0.203: U3.19 47.5,6.1 38.23,6.1 34.5,9.83 A0.1 23.67,9.83 21.97,8.13 20.07,8.13 19.4,8.79 6.45,8.79 5.08,10.16 5.08,10.95 5.69,11.56 v7.11,11.56
PC1  (via drill 0.3)
  Top 0.203: U4.24 6.16,10.62 v6.16,9.97
  Bottom 0.203: U3.20 49.66,6.48 38.5,6.48 A0.2 31.61,10.29 23.49,10.29 21.84,8.64 20.19,8.64 19.67,9.16 6.72,9.16 6.16,9.71 v6.16,9.97
PC2  (via drill 0.3, 0.3 pad 0.64)
  Top 0.203: v25.53,11.18 30.23,6.48 52.2,6.48 U3.21 | U4.25 7.61,10.15 v7.75,10.29
  Bottom 0.203: v25.53,11.18 23.62,11.18 22.27,9.83 A2.1 21.03,9.83 20.42,10.44 7.9,10.44 v7.75,10.29
PC3  (via drill 0.3, 0.3 pad 0.64)
  Top 0.203: U3.22 54.1,7.11 30.61,7.11 v26.54,11.18 | U4.26 8.41,11.21 v8.38,11.24
  Bottom 0.203: v26.54,11.18 25.91,11.81 21.1,11.81 A2.2 20.18,10.92 8.51,10.92 8.38,11.05 v8.38,11.24
PC4/SDA  (via drill 0.3, 0.3 pad 0.64)
  Top 0.152: 9.33,9.33 v9.33,11.56 | v19.05,11.56 19.05,8.06 v18.8,7.81 | 9.27,9.2 9.35,9.27
  Top 0.203: v31.88,8.38 41.77,8.38 I2C..2 | U3.17 22.99,49.4 22.99,24.26 v22.35,23.62 | 9.27,9.2 9.25,9.17 U4.27 9.33,9.29 9.33,9.33
  Bottom 0.152: v19.05,11.56 v9.33,11.56 | 19.11,7.81 v18.8,7.81
  Bottom 0.203: I2C..2 I2C...2 61.09,8.02 U3.23 | v31.88,8.38 23.24,8.38 21.97,7.11 19.81,7.11 19.11,7.81 18.92,8 6.1,8 4.19,9.91 4.19,11.37 5.84,13.02 5.84,15.67 10.62,20.45 19.81,20.45 22.35,22.99 v22.35,23.62
PC5/SCL  (via drill 0.3, 0.3 pad 0.64)
  Top 0.152: v9.97,12.32 9.97,9.33 9.96,9.27 9.96,9.2 U4.28
  Top 0.203: U3.24 63.63,3.48 I2C...1 | I2C..1 43.13,7.75 31.24,7.75 30.99,8 v30.99,9.02 | U3.18 22.35,47.5 v22.35,24.89
  Bottom 0.203: I2C...1 I2C..1 | v30.99,9.02 23.37,9.02 21.97,7.62 19.94,7.62 19.18,8.38 6.22,8.38 4.57,10.03 4.57,11.18 6.22,12.83 | v22.35,24.89 22.99,24.26 22.99,22.99 20.07,20.07 10.77,20.07 6.22,15.52 6.22,12.83 | 6.22,12.83 9.46,12.83 v9.97,12.32
PD0/RX  (via drill 0.3 pad 0.64, 0.35)
  Top 0.152: 17.91,34.42 v18.03,34.42
  Top 0.203: U3.1 63.63,44.12 UART.1 55.07,35.56 32.77,35.56 31.75,34.54 v31.75,34.42 31.75,24.38 24.51,17.14 24.51,12.95 v24.38,12.83 | v18.03,34.42 18.03,42.55 17.78,42.8 R1.1 | v19.94,12.83 19.3,12.83 14.22,7.75 12.19,7.75 11.61,8.33 U4.30
  Bottom 0.203: v31.75,34.42 v18.03,34.42 | v24.38,12.83 v19.94,12.83
PD1/TX  (via drill 0.3 pad 0.64)
  Top 0.203: U3.2 61.09,43.58 UART.2 53.45,35.94 32.37,35.94 31.11,34.68 v31.11,33.78 31.11,24.51 24.26,17.65 21.08,17.65 20.06,16.63 20.06,14.23 13.98,8.15 12.83,8.15 12.43,8.56 U4.31 | v19.05,33.78 19.05,34.42 18.41,35.05 18.41,42.8 17.65,43.56 15.62,43.56 R4.1
  Bottom 0.203: v31.11,33.78 v19.05,33.78
PD2/INT0
  Top 0.152: 13.15,9.53 13.15,9.33 13.16,9.27 | 13.16,9.27 13.16,9.2 | 13.16,9.27 U4.32
  Top 0.203: U3.3 58.37,50.93 D2.1 43.77,36.32 32.21,36.32 30.48,34.6 30.48,24.38 24.26,18.16 20.83,18.16 19.63,16.97 19.63,14.32 14.84,9.53 13.15,9.53
PD3/INT1  (via drill 0.3)
  Top 0.152: v30.29,35.37 30.29,35.05 30.36,34.98
  Top 0.203: U3.4 56.01,50.56 D2.2 43.21,37.77 D3.1 30.36,34.98 30.1,34.72 30.1,24.51 24.13,18.54 20.55,18.54 19.28,17.27 19.28,14.76 15.19,10.68 14.72,10.68 U4.1
PD4
  Top 0.203: U3.5 47.75,45.21 30.57,45.21 29.72,44.36 29.72,40.01 | 29.72,40.01 29.72,39.75 | D3.2 29.99,39.77 | 29.96,39.77 29.73,39.77 29.72,39.75 | 29.72,39.5 29.72,24.64 24,18.92 20.41,18.92 18.92,17.44 18.92,15.21 15.19,11.48 14.72,11.48 U4.2 | 29.99,39.77 29.96,39.77 | 29.96,39.77 29.72,40.01 | 29.99,39.77 29.72,39.5 | 29.72,39.5 29.72,39.75
  Bottom 0.203: D4.1 31.15,37.77 D3.2
PD5  (via drill 0.3 pad 0.64)
  Top 0.203: U3.6 45.59,45.59 30.33,45.59 29.08,44.34 v29.08,40.13 v29.08,24.89 29.08,24.51 23.88,19.3 14.22,19.3 13.21,18.29 13.21,18.28 U4.9
  Bottom 0.152: 32.2,21.72 32.23,21.75
  Bottom 0.203: D5.1 55.2,21.72 32.26,21.72 32.23,21.75 v29.08,24.89 | v29.08,40.13 21.45,40.13 D4.2
PD6  (via drill 0.3, 0.3 pad 0.64)
  Top 0.152: v12.51,16.64 12.51,17.59 | v32.51,22.35 v32.51,16.95
  Top 0.203: U3.7 43.43,45.97 30.1,45.97 28.45,44.32 v28.45,25.53 28.45,24.38 23.75,19.68 13.59,19.68 12.41,18.51 U4.10
  Bottom 0.152: v12.51,16.64 12.83,16.95 v32.51,16.95
  Bottom 0.203: D5.2 55.28,23.8 D6.1 43.77,22.35 v32.51,22.35 29.34,25.53 v28.45,25.53
PD7  (via drill 0.3, 0.3 pad 0.64)
  Top 0.152: D7.1 v33.15,21.08
  Top 0.203: U3.8 41.28,46.36 29.91,46.36 27.81,44.25 v27.81,26.16 27.81,24.26 23.62,20.07 12.84,20.07 11.61,18.84 U4.11
  Bottom 0.152: 20.13,19.49 21.72,21.08 v33.15,21.08
  Bottom 0.203: D6.2 43.21,23.8 D7.1 33.1,23.8 30.73,26.16 v27.81,26.16
RESET  (via drill 0.3, 0.3 pad 0.61, 0.3 pad 0.64)
  Top 0.152: 21.97,3.24 22.03,3.3 22.03,3.62 RESET.2
  Top 0.203: RESET.2 v21.97,5.46 13.4,5.46 v11.94,6.92 10.81,8.04 U4.29 | R11.2 16.51,29.08 v16.51,31.11 16.51,32.13 C6.2
  Bottom 0.203: U3.30 30.35,5.46 v21.97,5.46 | U3.36 58.04,31.11 v16.51,31.11 16.51,23.9 14.58,21.97 9.88,21.97 3.3,15.4 3.3,9.76 3.32,9.76 6.1,6.98 11.88,6.98 v11.94,6.92
USB_D+  (via drill 0.3, 0.3 pad 0.64)
  Top 0.152: 5.59,30.61 U$9.3
  Top 0.203: 6.73,30.86 6.97,30.86 7.3,31.19 7.3,33.59 5.71,35.18 v5.65,35.18 | 6.73,30.86 5.84,30.86 5.59,30.61 | v6.67,30.61 6.67,30.8 6.73,30.86 | U$44.5 7.62,40.58 v6.22,39.18
  Bottom 0.203: 8.38,29.46 D+1.T 7.11,30.61 v6.67,30.61 | v5.65,35.18 5.65,38.61 v6.22,39.18
USB_D-  (via drill 0.3, 0.3 pad 0.64)
  Top 0.152: 4.57,31.29 6.53,31.29 6.67,31.43 v6.67,31.62 | 4.57,31.24 4.57,31.29 | 4.57,31.29 4.47,31.29 U$9.2
  Top 0.203: v6.67,31.62 6.67,32.89 v4.63,34.93 | U$44.6 6.35,40.83 v4.7,39.18
  Bottom 0.203: v6.67,31.62 8.13,31.62 D-1.T | v4.63,34.93 4.63,39.12 v4.7,39.18
VBUS  (via drill 0.3 pad 0.64)
  Top 0.813: v6.35,28.32 F1.1
  Bottom 0.813: VCC.T 6.86,34.42 5.71,33.27 v5.71,32.26 5.71,28.96 v6.35,28.32
  pour Top (isolate 0.254, no thermals): 3.81,32.51 5.97,32.51 5.97,31.81 3.81,31.81
VCC  (via drill 0.3, 0.3 pad 0.64, 0.35)
  Top 0.152: v9.02,38.23 9.02,41.72 8.97,41.73 8.97,41.81 | 13.46,29.65 13.46,29.46 C12.1 | v13.78,41.72 13.78,39.18 v12.83,38.23 12.83,36.64 12.78,36.63 U$44.16 | 5.84,15.37 5.92,15.44 6.07,15.44 U4.18 | 8.97,41.81 8.89,41.89 U$44.4 8.97,41.81
  Top 0.203: U4.18 3.84,15.46 C9.2
  Top 0.305: U4.6 16.2,14.66 v16.64,14.22 16.64,13.59 16.11,13.06 U4.4
  Top 0.406: 21,27.88 A6.3 | 13.46,29.46 R11.1
  Top 0.61: 21.07,27.81 A6.3
  Top 0.813: D5.3 58.18,27.8 59.18,26.8 59.18,23.62 | 59.18,22.99 59.18,22.35 | 59.18,22.35 59.18,14.73 58.28,13.83 I2C...3 | U3.33 67.82,28.96 67.82,24 66.8,22.99 59.82,22.99 | 59.82,22.99 59.18,22.99 | 59.82,22.99 59.18,23.62 | 59.82,22.99 59.18,22.35 | 59.18,22.99 59.18,23.62 | U3.28 36.32,4.57 31.11,4.57 | 31.11,4.57 30.1,4.57 | 30.1,4.57 28.7,4.57 26.67,6.6 24.13,6.6 | U3.31 30.61,4.06 | 30.61,4.06 31.11,4.57 | 30.61,4.06 30.1,4.57 | 24.13,6.6 23.11,6.6 | A2.3 21.73,13.83 23.62,11.94 23.62,7.11 | 23.62,7.11 23.11,6.6 | 23.62,7.11 24.13,6.6 | 23.11,6.6 v14.86,6.6 | U1.3 6.35,24.51 7.37,25.53 C8.+ 8.76,25.53 v10.29,27.05 F1.2 11.43,29.46 C15.1 C12.1 | R9.1 10.29,5.84 v11.18,5.84 | v4.7,17.91 4.44,17.91 C7.2 C9.2
  Bottom 0.152: v9.02,38.23 v12.83,38.23 | v16.64,14.22 16.64,14.1 | v13.78,41.72 20.76,41.72 D4.3
  Bottom 0.203: 16.64,14.35 v16.64,14.22
  Bottom 0.813: A6.3 D7.3 D6.3 D5.3 | D4.3 D3.3 D2.3 UART.3 61.36,41.77 62.99,40.13 62.99,35.05 66.17,31.88 U3.33 | I2C...3 I2C..3 A0.3 A2.3 20.56,14.35 16.64,14.35 | v14.86,6.6 14.1,5.84 v11.18,5.84 6.1,5.84 2.54,9.4 2.54,15.75 v4.7,17.91 10.29,23.49 v10.29,27.05
XTAL1
  Top 0.203: U4.7 16.54,15.46 Y1.1
XTAL2
  Top 0.152: U4.8 14.92,16.48 14.92,18.22 15.37,18.67 16.45,18.67
  Top 0.203: Y1.3 16.5,18.73 16.45,18.67

### Text on the board
tPlace: D13 | 9 | 8 | 7 | 6 | 5 | 4 | 3 | 2 | 1 | 0 | 13 | 12 | 11 | 10 | * | * | * | * | SCL | SDA | AREF | GND | * | * | TX | RX | GND | GND | GND | GND | VCC | VCC | VCC | VCC | D5 | D4 | D3 | TX | D4 | D3 | D2 | RX | GND | GND | GND | GND | VCC | VCC | VCC | VCC | D6 | A7 | D8 | D7 | D5 | A6 | D7 | D6 | MISO | VCC | SCK | MOSI | RST | GND | GND | GND | GND | GND | VCC | VCC | VCC | VCC | A3 | A1 | SDA | SDA | A2 | A0 | SCL | SCL | ANALOG IN | A6 | IORef | RST | 3V3 | 5V | GND | GND | NC | 0 | 1 | 2 | 3 | 4 | 5
bPlace: Blocky Uno
bPlate: A0 | A2 | A4 | SPI | UART